# Altium schematic sheet AC to DC Power Supply.SchDoc
size 199 x 100 mm; SheetNumber: 1; SheetTotal: 1
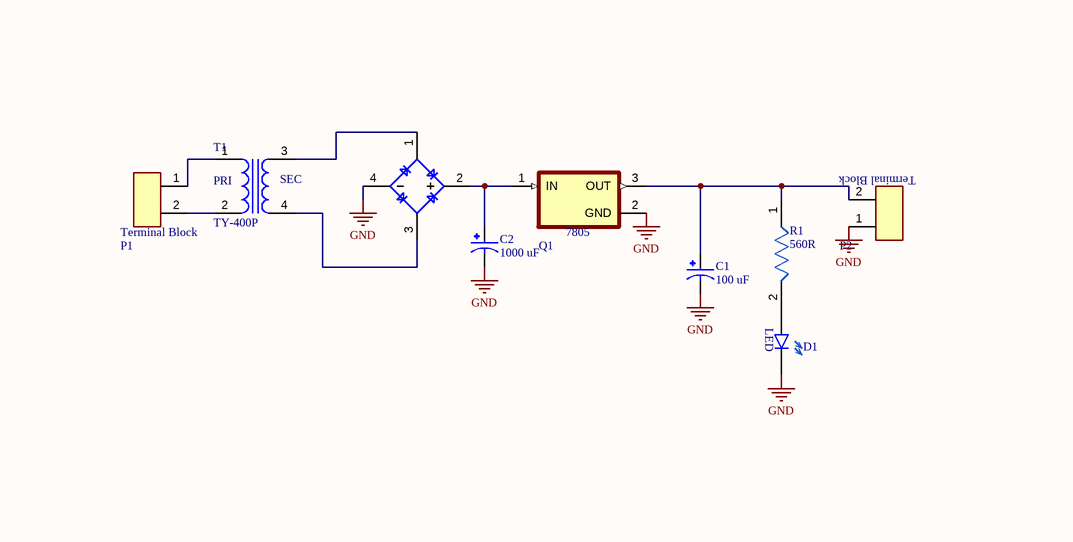
[diagram p0: AC to DC Power Supply.SchDoc]

## Parts
?  (no value)  [*DIOB_ABS8_REG]
C1  100 uF  [Capacitor (Polar)]
C2  1000 uF  [Capacitor (Polar)]
D1  self  [LED (RED)]  (value not drawn)
P1  Terminal Block 2 Pin  [Terminal Block 2 Pin]  (value not drawn)
P2  Terminal Block 2 Pin  [Terminal Block 2 Pin]  (value not drawn)
Q1  LM7805CT/NOPB  [LM7805CT/NOPB - duplicate]  (value not drawn)
R1  560R  [Resistor]
T1  TY-400P  [XFMR_TY-400P]

## Nets
GND: ?.4 C1.N C2.N D1.2 P2.1 Q1.2(GND)
Net?_1: ?.1 T1.3
Net?_2: ?.2 C2.P Q1.1(IN)
Net?_3: ?.3 T1.4
NetC1_P: C1.P P2.2 Q1.3(OUT) R1.1
NetD1_1: D1.1 R1.2
NetP1_1: P1.1 T1.1
NetP1_2: P1.2 T1.2

## Notes on the sheet
- (in symbol LED (Red)) LED
- (in symbol LM7805CT/NOPB) 7805
- (in symbol Terminal Block 2 Pin) Terminal Block
- (in symbol TY-400P) PRI; SEC

## Library data of the parts
? = Component_1
C1 C2 = Capacitor (Polar): CAP ALUM 1UF 20% 50V RADIAL; MP: EEU-EB1H1R0SB; MF: Panasonic Electronic Components; Package: RADIAL-2 Panasonic; Price: None; Availability: Not in stock; Check_prices: https://www.snapeda.com/parts/EEU-EB1H1R0SB/Panasonic/view-part/6222296/?ref=eda; SnapEDA_Link: https://www.snapeda.com/parts/EEU-EB1H1R0SB/Panasonic/view-part/6222296/?ref=snap; Value: *
D1 = LED (Red): Red
P1 P2 = Terminal Block 2 Pin: 2 pin; MF: TE Connectivity; MP: 282837-2; SnapEDA_Link: https://www.snapeda.com/parts/282837-2/TE+Connectivity+AMP+Connectors/view-part/?ref=snap; Price: None; Check_prices: https://www.snapeda.com/parts/282837-2/TE+Connectivity+AMP+Connectors/view-part/?ref=eda; Purchase-URL: https://pricing.snapeda.com/search/part/282837-2/?ref=eda; Value: *; Availability: In Stock; Package: None
Q1 = LM7805CT/NOPB: 1.5-A, 30-V, linear voltage regulator; MF: Comset Semiconductors; Price: None; Availability: Not in stock; MP: LM7805CT; Package: TO-220 Comset Semiconductors; SnapEDA_Link: https://www.snapeda.com/parts/LM7805CT/Comset+Semiconductors/view-part/?ref=snap; Check_prices: https://www.snapeda.com/parts/LM7805CT/Comset+Semiconductors/view-part/?ref=eda; Value: *
R1 = Resistor
T1 = TY-400P: Transformer, audio, FCC68, 600:600, 90mADC | Triad Magnetics TY-400P; SnapEDA_Link: https://www.snapeda.com/parts/TY-400P/Triad+Magnetics/view-part/?ref=snap; Package: None; Value: *; MF: Triad Magnetics; MP: TY-400P; Check_prices: https://www.snapeda.com/parts/TY-400P/Triad+Magnetics/view-part/?ref=eda